# Altium schematic sheet [01] COVER PAGE.SchDoc: template
size A4; Author: Hom; CompanyName: KitSprout; DrawnBy: Hom; Engineer: Hom; Organization: KitSprout; Revision: A; SheetNumber: 1; SheetTotal: 1; Version: v1.0A; LibVersion: v2.17
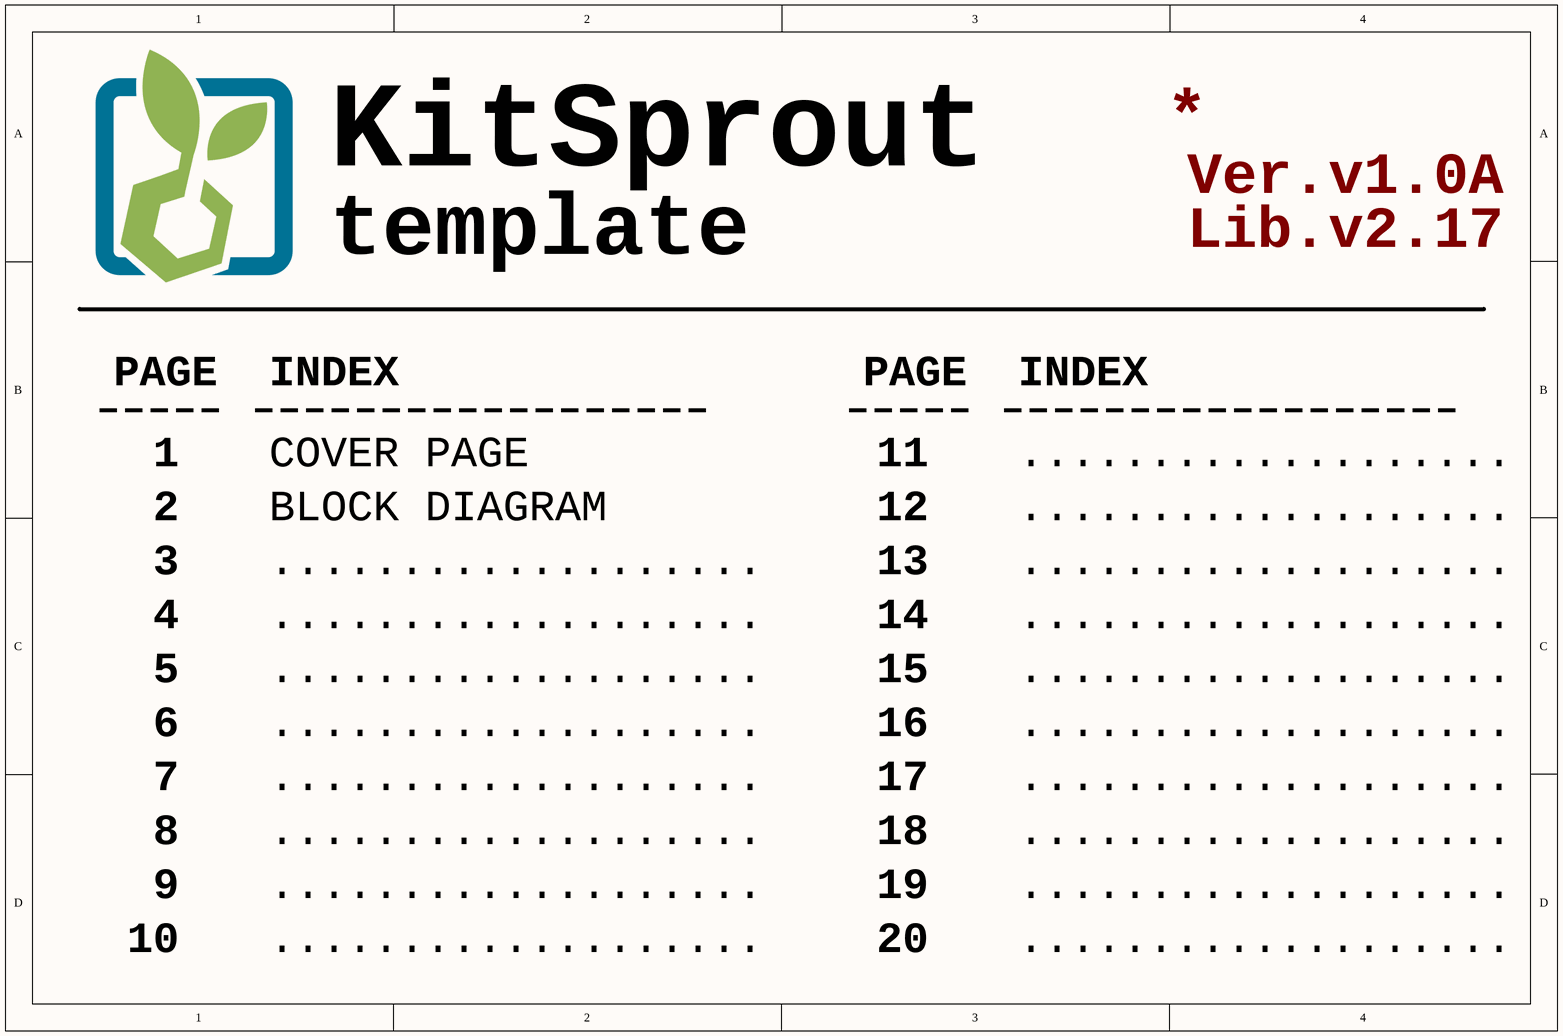
[diagram p0: [01] COVER PAGE.SchDoc]

## Notes on the sheet
- Ver.
- Lib.
- PAGE
- INDEX
- 1
- COVER PAGE
- 11
- ...................
- 2
- 3
- BLOCK DIAGRAM
- 12
- 13
- 4
- 14
- 5
- 15
- 6
- 16
- 7
- 8
- 17
- 18
- 9
- 19
- 10
- 20